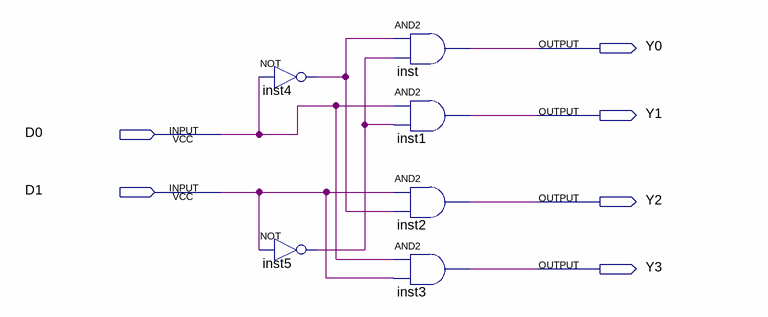
[diagram p0: schematic sheet]
// Quartus schematic Aula02_Decodificador.bdf as structural Verilog: 6 symbols, 6 pins
module Aula02_Decodificador (
  input  D0,
  input  D1,
  output Y0,
  output Y1,
  output Y2,
  output Y3
);

  wire inst4_out, inst5_out;

  not inst4 (inst4_out, D0);
  not inst5 (inst5_out, D1);
  and inst (Y0, inst4_out, inst5_out);
  and inst1 (Y1, D0, inst5_out);
  and inst2 (Y2, D1, inst4_out);
  and inst3 (Y3, D0, D1);
endmodule
